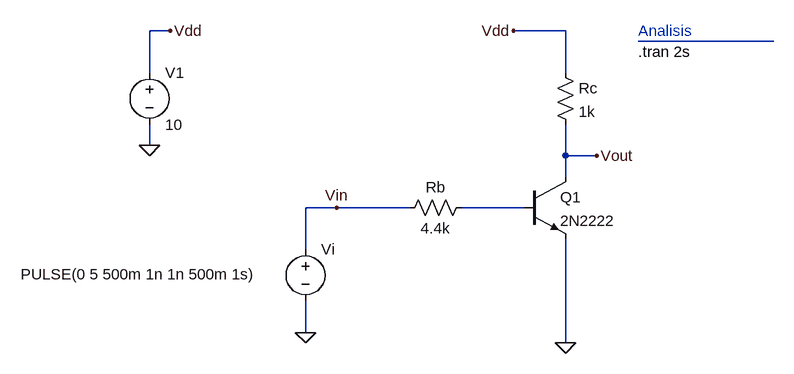
[diagram p0: schematic bjt_switch-ejemplo2.asc]
bjt_switch-ejemplo2.asc, the LTspice schematic file:
Version 4
SHEET 1 880 680
WIRE -528 -176 -560 -176
WIRE 80 -176 0 -176
WIRE 400 -160 192 -160
WIRE -560 -112 -560 -176
WIRE 80 -112 80 -176
WIRE -560 0 -560 -32
WIRE 80 16 80 -32
WIRE 128 16 80 16
WIRE 80 48 80 16
WIRE -272 96 -320 96
WIRE -160 96 -272 96
WIRE 16 96 -80 96
WIRE -320 160 -320 96
WIRE -320 288 -320 240
WIRE 80 304 80 144
FLAG 80 304 0
FLAG -560 0 0
FLAG -528 -176 Vdd
FLAG -320 288 0
FLAG 0 -176 Vdd
FLAG 128 16 Vout
FLAG -272 96 Vin
SYMBOL npn 16 48 R0
SYMATTR InstName Q1
SYMATTR Value 2N2222
SYMBOL res -64 80 R90
WINDOW 0 0 56 VBottom 2
WINDOW 3 32 56 VTop 2
SYMATTR InstName Rb
SYMATTR Value 4.4k
SYMBOL res 64 -128 R0
SYMATTR InstName Rc
SYMATTR Value 1k
SYMBOL voltage -560 -128 R0
WINDOW 123 0 0 Left 0
WINDOW 39 0 0 Left 0
SYMATTR InstName V1
SYMATTR Value 10
SYMBOL voltage -320 144 R0
WINDOW 3 -438 54 Left 2
WINDOW 123 0 0 Left 0
WINDOW 39 0 0 Left 0
SYMATTR Value PULSE(0 5 500m 1n 1n 500m 1s)
SYMATTR InstName Vi
TEXT 192 -144 Left 2 !.tran 2s
TEXT 192 -176 Left 2 ;Analisis

The netlist it stands for:
* bjt_switch-ejemplo2.asc
Q1 Vout N002 0 0 2N2222
Rb N002 Vin 4.4k
Rc Vdd Vout 1k
V1 Vdd 0 10
Vi Vin 0 PULSE(0 5 500m 1n 1n 500m 1s)
.model NPN NPN
.model PNP PNP
.lib standard.bjt
.tran 2s
* Analisis
.backanno
.end